# EAGLE design house-sensor4pre (EAGLE 6.4)
House Sensor API Project w/ Raspberry Pi
Assembly variants: attr
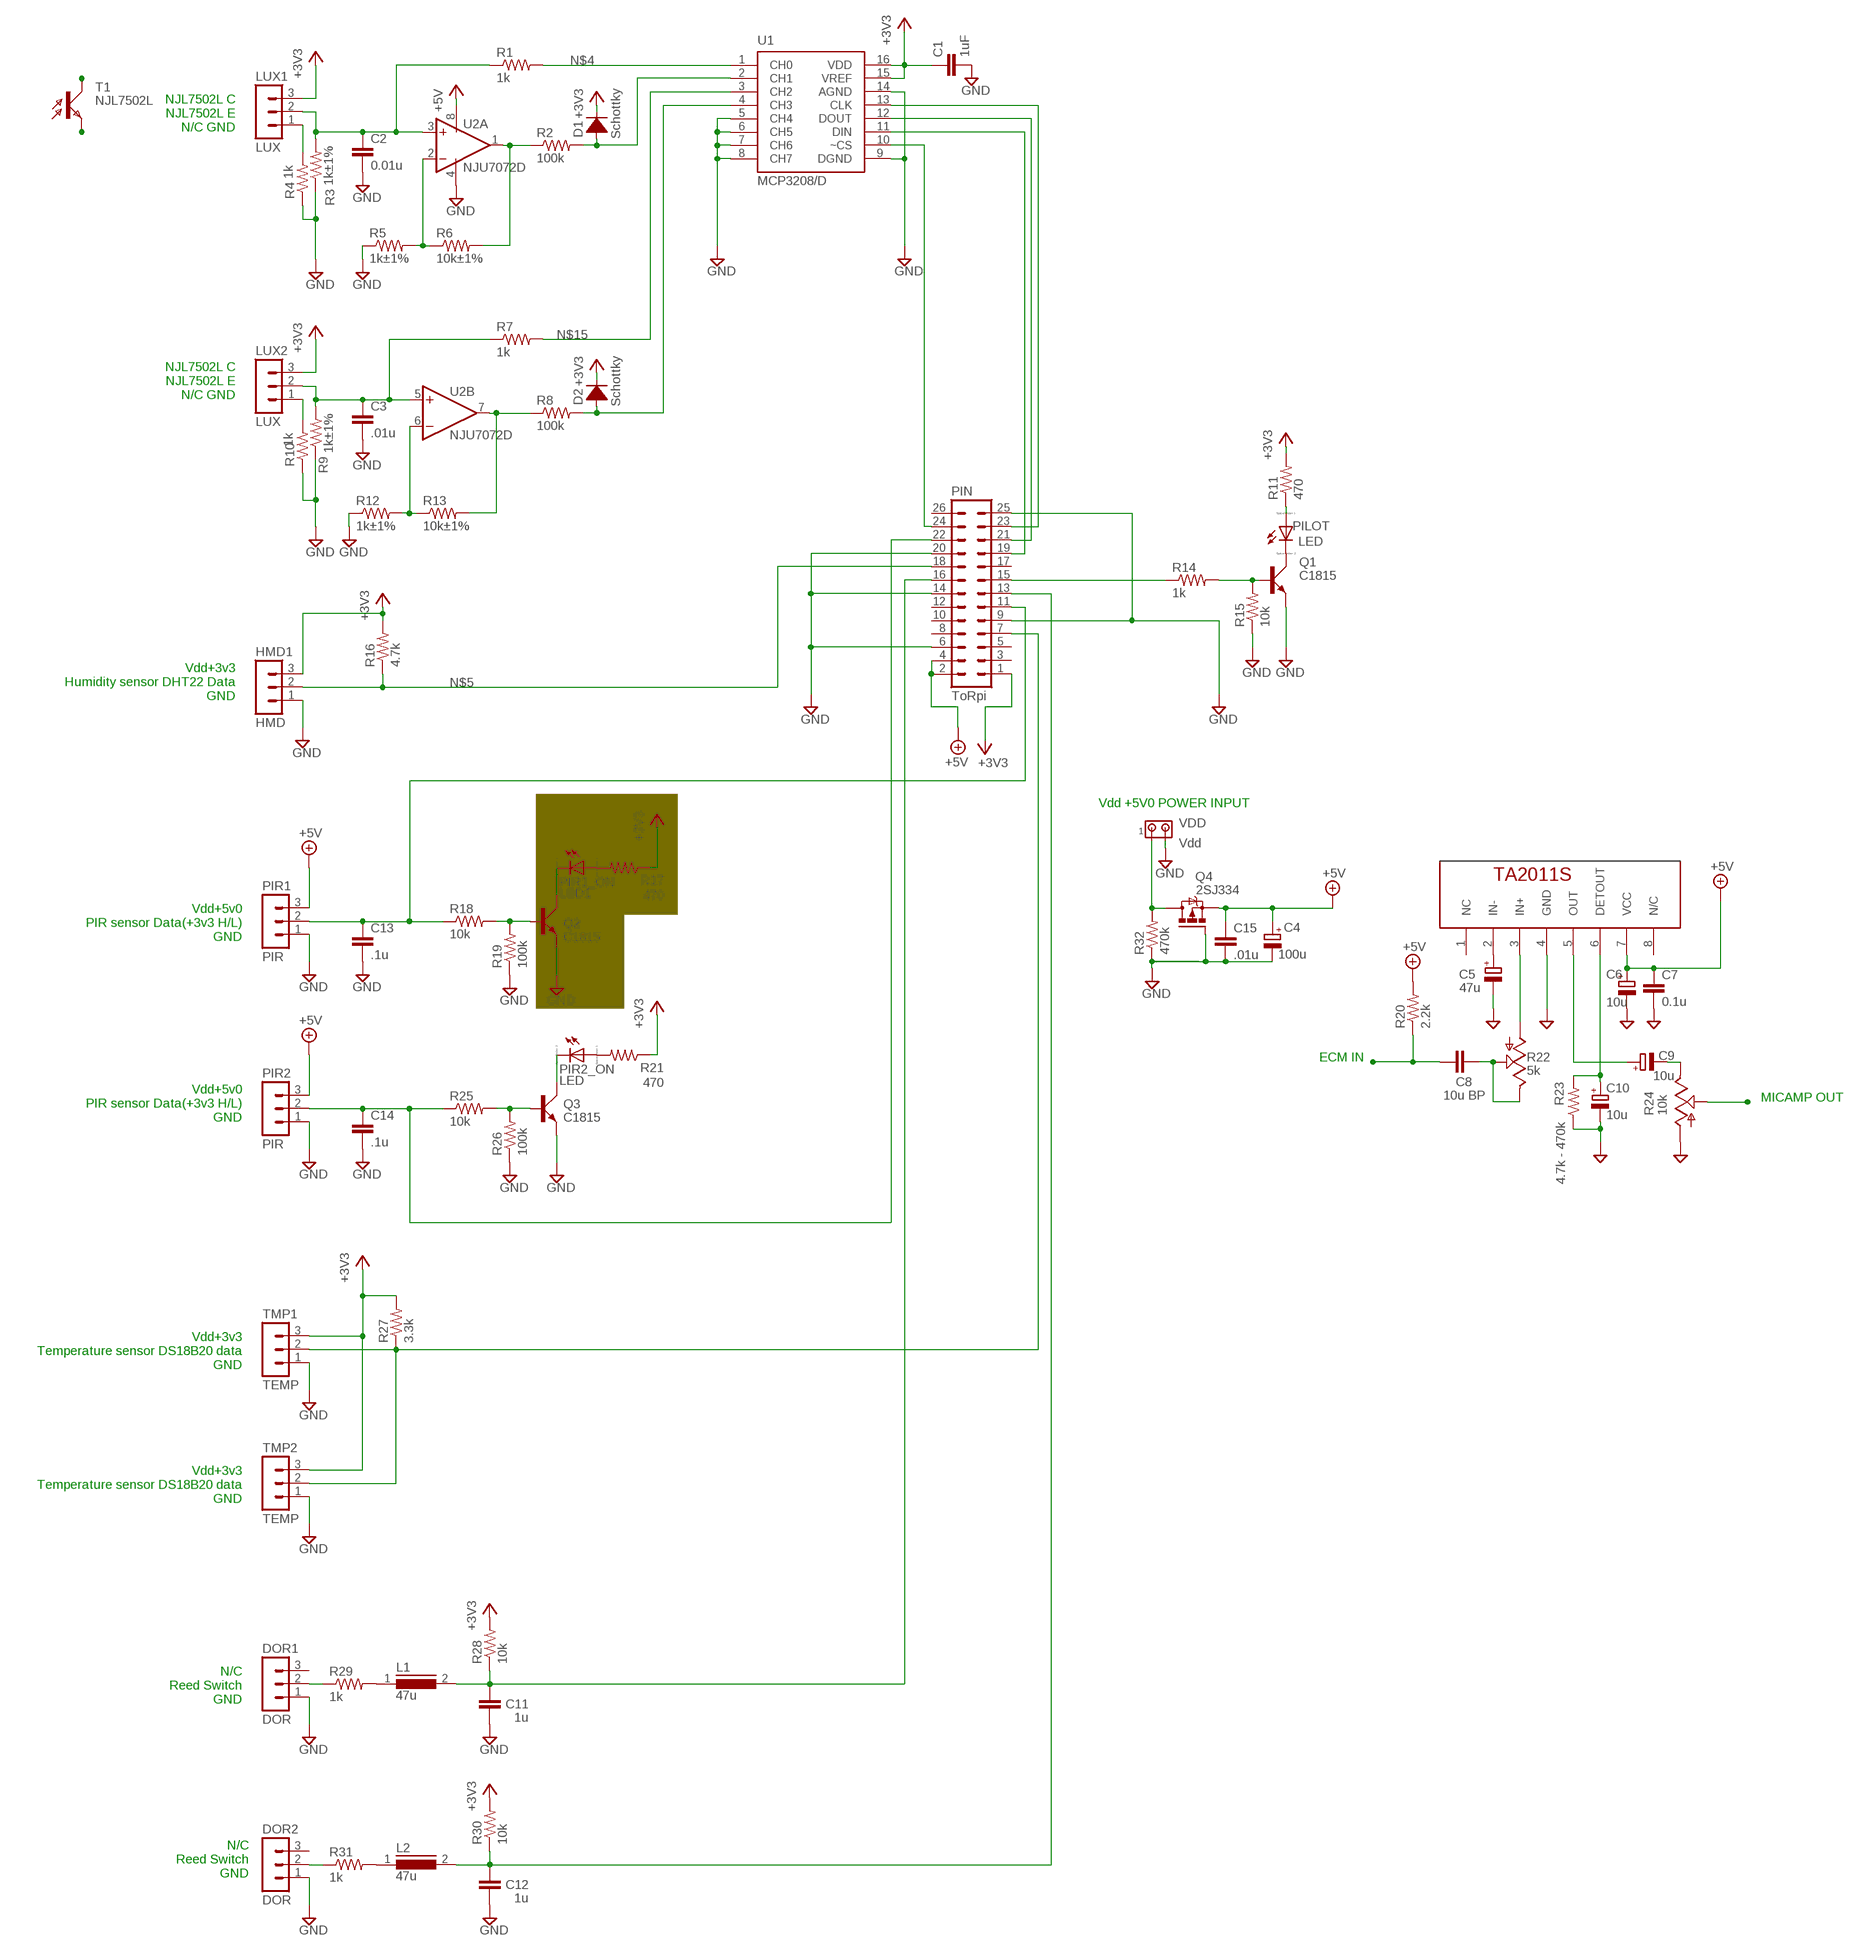
[diagram p0: schematic, sheet 1]

## Parts
C1  1uF  C-EU025-025X050  [C025-025X050]  (variant attr: a)
C2  0.01u  C-EU025-024X044  [C025-024X044]
C3  .01u  C-EU025-024X044  [C025-024X044]
C4  100u  CPOL-EUE1.8-4  [E1,8-4]
C5  47u  CPOL-EUE1.8-4  [E1,8-4]
C6  10u  CPOL-EUE1.8-4  [E1,8-4]
C7  0.1u  C  [C025-024X044]
C8  10u BP  C  [C025-024X044]
C9  10u  CPOL-EUE1.8-4  [E1,8-4]
C10  10u  CPOL-EUE1.8-4  [E1,8-4]
C11  1u  C-EU050-024X044  [C050-024X044]
C12  1u  C-EU050-024X044  [C050-024X044]
C13  .1u  C-EU025-030X050  [C025-030X050]
C14  .1u  C-EU025-030X050  [C025-030X050]
C15  .01u  C-EU025-025X050  [C025-025X050]
D1  Schottky  DIODE_V  [DIODE_V]
D2  Schottky  DIODE_V  [DIODE_V]
DOR1  DOR  MA03-1  [MA03-1]
DOR2  DOR  MA03-1  [MA03-1]
HMD1  HMD  MA03-1  [MA03-1]
L1  47u  LBC-SE  [LBC-SE]
L2  47u  LBC-SE  [LBC-SE]
LUX1  LUX  MA03-1  [MA03-1]
LUX2  LUX  MA03-1  [MA03-1]
PILOT  LED  LED_ELD260  [LED_LD260]
PIN  ToRpi  MA13-2  [MA13-2]
PIR1  PIR  MA03-1  [MA03-1]
PIR1_ON  LED1  LED_ELD260  [LED_LD260]
PIR2  PIR  MA03-1  [MA03-1]
PIR2_ON  LED  LED_ELD260  [LED_LD260]
Q1  C1815  2SC1815  [TO92-LINE]
Q2  C1815  2SC1815  [TO92-LINE]
Q3  C1815  2SC1815  [TO92-LINE]
R1  1k  R-US_0207/2V  [0207/2V]
R2  100k  R-US_0207/10  [0207/10]
R3  1k±1%  R-US_0207/2V  [0207/2V]
R4  1k  R-US_0309/V  [0309V]
R5  1k±1%  R-US_0207/2V  [0207/2V]
R6  10k±1%  R-US_0207/2V  [0207/2V]
R7  1k  R-US_0207/2V  [0207/2V]
R8  100k  R-US_0204/7  [0204/7]
R9  1k±1%  R-US_0207/2V  [0207/2V]
R10  1k  R-US_0309/V  [0309V]
R11  470  R-US_0207/2V  [0207/2V]
R12  1k±1%  R-US_0207/2V  [0207/2V]
R13  10k±1%  R-US_0207/2V  [0207/2V]
R14  1k  R-US_0204/2V  [0204V]
R15  10k  R-US_0207/2V  [0207/2V]
R16  4.7k  R-US_0207/2V  [0207/2V]
R17  470  R-US_0204/2V  [0204V]
R18  10k  R-US_0204/2V  [0204V]
R19  100k  R-US_0204/2V  [0204V]
R20  2.2k  R-US_0207/2V  [0207/2V]
R21  470  R-US_0204/2V  [0204V]
R22  5k  TRIM_US-B25P  [B25P]
R23  4.7k - 470k  R-US_0207/2V  [0207/2V]
R24  10k  TRIM_US-B25P  [B25P]
R25  10k  R-US_0204/2V  [0204V]
R26  100k  R-US_0204/2V  [0204V]
R27  3.3k  R-US_0204/2V  [0204V]
R28  10k  R-US_0204/2V  [0204V]
R29  1k  R-US_0207/5V  [0207/5V]
R30  10k  R-US_0204/2V  [0204V]
R31  1k  R-US_0207/5V  [0207/5V]
R32  470k  R-US_0204/2V  [0204V]
T1  NJL7502L  BPX81  [BPX81]
TMP1  TEMP  MA03-1  [MA03-1]
TMP2  TEMP  MA03-1  [MA03-1]
U1  MCP3208/D  MCP3208/DIP  [DIL16]
U2  NJU7072D  LM358N  [DIL08]
U$1  TA2011S  [SIP8]
VDD  Vdd  MTA02-100  [10X02MTA]

## Nets
+3V3: C1.1 D1.P$2(K) D2.P$2(K) HMD1.3 LUX1.3 LUX2.3 PIN.1 R11.2 R16.2 R17.1 R21.1 R27.2 R28.2 R30.2 TMP1.3 TMP2.3 U1.15(VREF) U1.16(VDD)
+5V: C4.+ C6.+ C7.1 C15.1 PIN.2 PIN.4 PIR1.3 PIR2.3 R20.2 U2.8(P:V+) U$1.7(VCC)
GND: C1.2 C2.2 C3.2 C4.- C5.- C6.- C7.2 C10.- C11.1 C12.1 C13.2 C14.2 C15.2 DOR1.1 DOR2.1 HMD1.1 PIN.6 PIN.9 PIN.14 PIN.20 PIN.25 PIR1.1 PIR2.1 Q1.3(E) Q2.3(E) Q3.3(E) R3.1 R4.1 R5.1 R9.1 R10.1 R12.1 R15.1 R19.1 R23.1 R24.A R26.1 R32.1 TMP1.1 TMP2.1 U1.5(CH4) U1.6(CH5) U1.7(CH6) U1.8(CH7) U1.9(DGND) U1.14(AGND) U2.4(P:V-) U$1.4(GND) VDD.2
N$1: C2.1 LUX1.2 R1.1 R3.2 U2.3(A:+IN)
N$2: R5.2 R6.1 U2.2(A:-IN)
N$3: R2.1 R6.2 U2.1(A:OUT)
N$4: R1.2 U1.1(CH0)
N$5: HMD1.2 PIN.18 R16.1
N$6: PIN.23 U1.13(CLK)
N$7: D1.P$1(A) R2.2 U1.2(CH1)
N$8: PIN.21 U1.12(DOUT)
N$9: PIN.19 U1.11(DIN)
N$10: R12.2 R13.1 U2.6(B:-IN)
N$11: R8.1 R13.2 U2.7(B:OUT)
N$12: C3.1 LUX2.2 R7.1 R9.2 U2.5(B:+IN)
N$13: PIN.24 U1.10(~CS)
N$14: D2.P$1(A) R8.2 U1.4(CH3)
N$15: R7.2 U1.3(CH2)
N$16: Q1.1(B) R14.2 R15.2
N$17: C13.1 PIN.11 PIR1.2 R18.1
N$18: Q2.1(B) R18.2 R19.2
N$19: PIR1_ON.K(C) Q2.2(C)
N$20: PIR1_ON.A R17.2
N$21: C14.1 PIN.22 PIR2.2 R25.1
N$22: Q3.1(B) R25.2 R26.2
N$23: PIR2_ON.K(C) Q3.2(C)
N$24: PIR2_ON.A R21.2
N$25: PILOT.K(C) Q1.2(C)
N$26: PILOT.A R11.1
N$27: PIN.7 R27.1 TMP1.2 TMP2.2
N$28: C12.2 L2.2 PIN.13 R30.1
N$29: R22.A U$1.3(IN+)
N$30: PIN.15 R14.1
N$31: L1.1 R29.2
N$32: DOR1.2 R29.1
N$33: L2.1 R31.2
N$34: DOR2.2 R31.1
N$35: C11.2 L1.2 PIN.16 R28.1
N$36: C9.+ U$1.5(OUT)
N$37: C9.- R24.E
N$38: LUX1.1 R4.2
N$39: LUX2.1 R10.2
N$40: R24.S
N$43: C8.2 R22.E R22.S
N$44: C8.1 R20.1
N$45: C10.+ R23.2 U$1.6(DETOUT)
N$46: C5.+ U$1.2(IN-)
N$47: T1.C
N$48: T1.E
N$49: R32.2 VDD.1
Unconnected: DOR1.3 DOR2.3 PIN.3 PIN.5 PIN.8 PIN.10 PIN.12 PIN.17 PIN.26 U$1.1(NC) U$1.8(N/C)

## Notes on the sheet
- NJL7502L C
  NJL7502L E
  N/C GND
- NJL7502L C
  NJL7502L E
  N/C GND
- Vdd+3v3
  Humidity sensor DHT22 Data
  GND
- Vdd +5V0 POWER INPUT
- Vdd+5v0
  PIR sensor Data(+3v3 H/L)
  GND
- ECM IN
- MICAMP OUT
- Vdd+5v0
  PIR sensor Data(+3v3 H/L)
  GND
- Vdd+3v3
  Temperature sensor DS18B20 data
  GND
- Vdd+3v3
  Temperature sensor DS18B20 data
  GND
- N/C
  Reed Switch
  GND
- N/C
  Reed Switch
  GND

## Library data of the parts
C1-C3 C11-C15 = akihabara:C-EU: CAPACITOR, European symbol
C4 = resistor:CPOL-EU: POLARIZED CAPACITOR, European symbol
C5 C6 C9 = rcl:CPOL-EU: POLARIZED CAPACITOR, European symbol
C7 C8 = akihabara:C
C10 = akihabara:CPOL-EU: POLARIZED CAPACITOR, European symbol
D1 D2 = 1-diode:DIODE_V: diode vertical
DOR1 DOR2 HMD1 LUX1 LUX2 PIR1 PIR2 TMP1 TMP2 = con-lstb:MA03-1: PIN HEADER; OC_FARNELL: unknown; OC_NEWARK: unknown
L1 L2 = inductors:LBC-SE: INDUCTOR
PILOT PIR1_ON PIR2_ON = eagle-ltspice:LED_E: LED Source: http://www.osram.convergy.de Source: www.luxeon.com Source: www.kingbright.com; SPICEMODEL: NONE; SPICEPREFIX: D; SPICETYPE: diode
PIN = con-lstb:MA13-2: PIN HEADER; OC_FARNELL: unknown; OC_NEWARK: unknown
Q1-Q3 = akihabara:2SC1815: 2SC1815 Audio frequency general purpose amplifier. Package ECB. Complementary to 2SA1015
R1-R21 R23 R25-R32 = akihabara:R-US_: RESISTOR, American symbol
R22 R24 = akihabara:TRIM_US-: POTENTIOMETER
T1 = opto-trans-siemens:BPX81: PHOTO TRANSISTOR; OC_FARNELL: unknown; OC_NEWARK: unknown
U1 = mcp3208:MCP3208/DIP
U2 = linear:LM358: OP AMP also LM158; LM258; LM2904 Source: http://cache.national.com/ds/LM/LM158.pdf
U$1 = ta2011:TA2011S
VDD = con-amp:MTA02-100: AMP connector

## Board
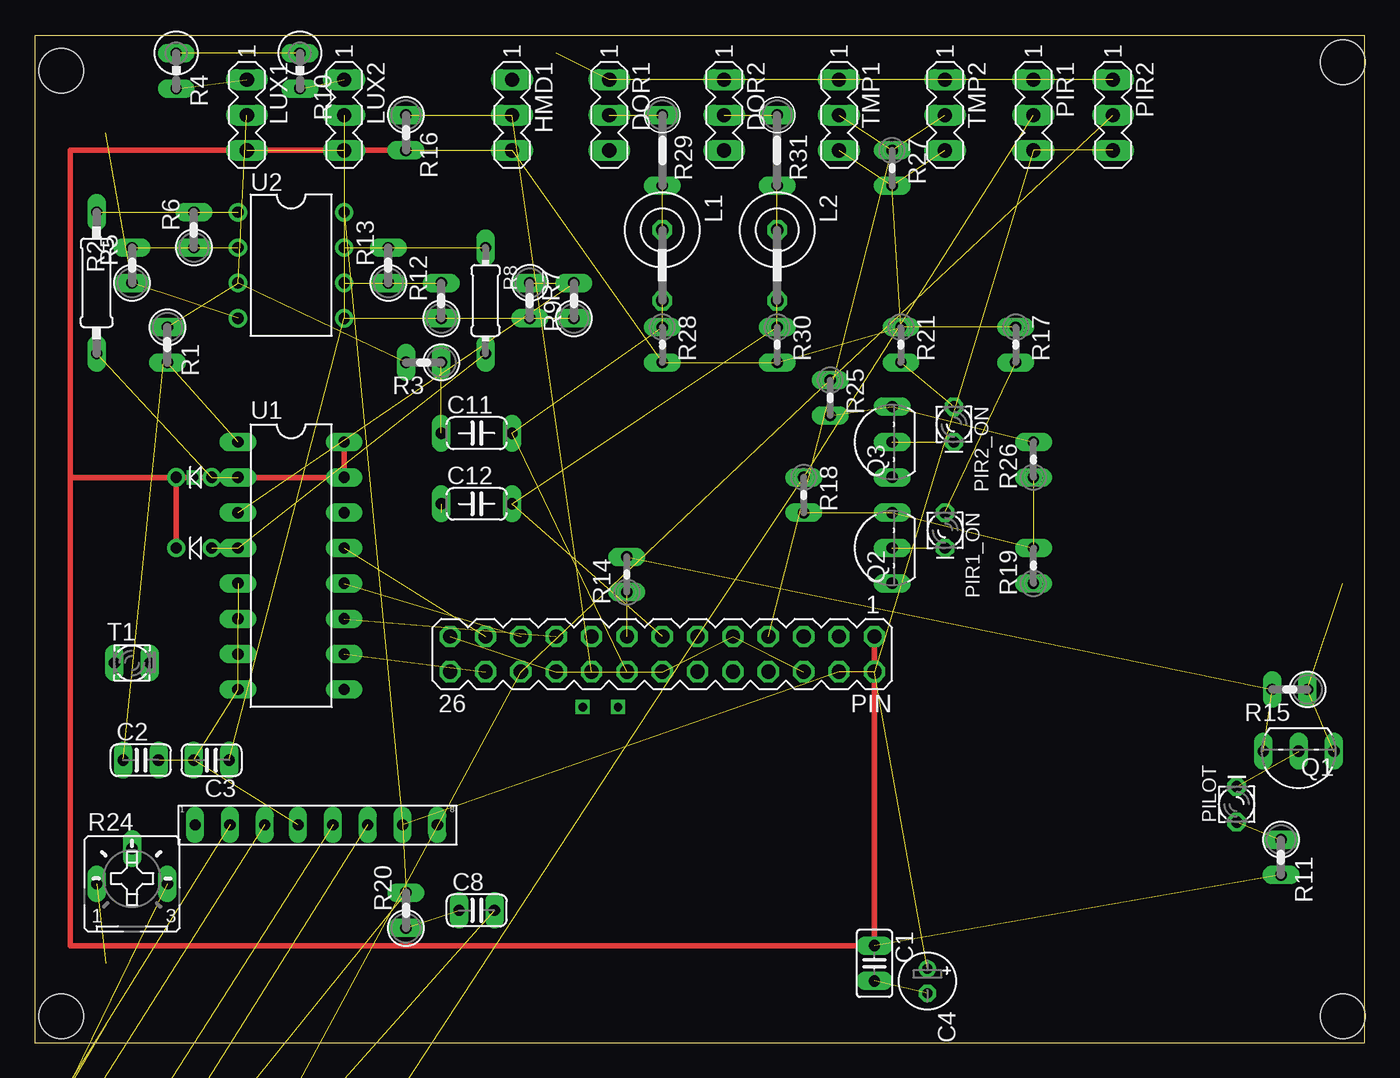
[diagram p1: board, top side]
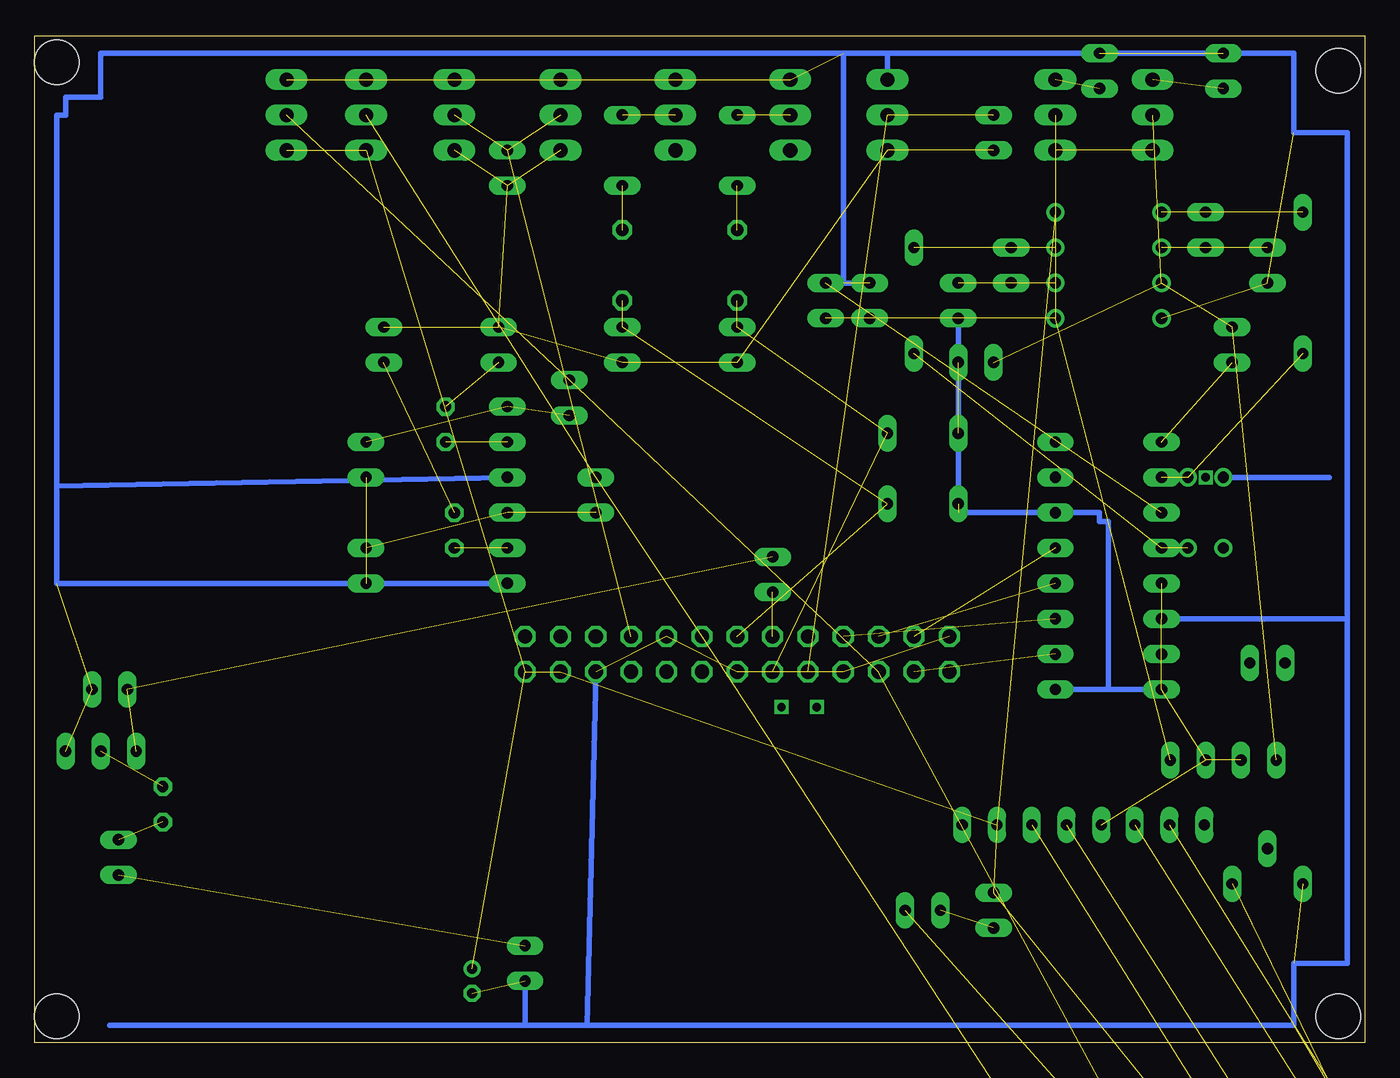
[diagram p2: board, bottom side, seen from below]

Size 95.56 x 72.38 mm. Coordinates in mm from the lower left corner, seen from the top.
Outline: 0,0 95.56,0 95.56,72.38 0,72.38 0,0
Copper layers (1*16): Top 0.035mm / dielectric 1.5mm / Bottom 0.035mm
Design rules "default": minimum track width 10mil, minimum drill 24mil, track to track 12mil, track to pad 12mil, pad to pad 12mil, via to via 12mil, smd to smd 12mil, copper to edge 40mil, drill to drill 8mil, minimum pad ring 10mil, minimum via ring 8mil, stop-mask expansion 4mil, vias tented up to drill 0mil, thermal gap 10mil
Holes 3.2 mm at 1.91,69.85 1.91,1.91 93.98,1.91 93.98,70.48

### Footprints (pad centres in the part's own frame; a part is rotated, then mirrored left to right if it is on the bottom)
C025-025X050 = drill 0.813 long: 1 -1.27,0; 2 1.27,0
C025-024X044 = drill 0.813 long: 1 -1.27,0; 2 1.27,0
E1,8-4 = drill 0.711 pad 1.168: + -0.889,0 | drill 0.711 pad 1.168 octagon: - 0.889,0
E1,8-4' = drill 0.711 pad 1.168 long: + -0.889,0; - 0.889,0
C050-024X044 = drill 0.813 long: 1 -2.54,0; 2 2.54,0
C025-030X050 = drill 0.813 long: 1 -1.27,0; 2 1.27,0
DIODE_V = drill 0.8: P$1 -2.54,0; P$2 0,0
MA03-1 = drill 1.016 long: 1 -2.54,0; 2 0,0; 3 2.54,0
LBC-SE = drill 0.914 octagon: 1 -2.54,0; 2 2.54,0
LED_LD260 = drill 0.813 octagon: A -1.27,0; K 1.27,0
MA13-2 = drill 1.016 octagon: 1 -15.24,-1.27; 2 -15.24,1.27; 3 -12.7,-1.27; 4 -12.7,1.27; 5 -10.16,-1.27; 6 -10.16,1.27; 7 -7.62,-1.27; 8 -7.62,1.27; 9 -5.08,-1.27; 10 -5.08,1.27; 11 -2.54,-1.27; 12 -2.54,1.27; 13 0,-1.27; 14 0,1.27; 15 2.54,-1.27; 16 2.54,1.27; 17 5.08,-1.27; 18 5.08,1.27; 19 7.62,-1.27; 20 7.62,1.27; 21 10.16,-1.27; 22 10.16,1.27; 23 12.7,-1.27; 24 12.7,1.27; 25 15.24,-1.27; 26 15.24,1.27
TO92-LINE = drill 0.813 long: 1 2.54,0; 2 0,0; 3 -2.54,0
0207/2V = drill 0.813 long: 1 -1.27,0; 2 1.27,0
0207/10 = drill 0.813 long: 1 -5.08,0; 2 5.08,0
0309V = drill 0.813 long: 1 -1.27,0; 2 1.27,0
0204/7 = drill 0.813 long: 1 -3.81,0; 2 3.81,0
0204V = drill 0.813 long: 1 -1.27,0; 2 1.27,0
B25P = drill 0.813 long: A -2.54,0; E 2.54,0; S 0,2.54
0207/5V = drill 0.813 long: 1 -2.54,0; 2 2.54,0
BPX81 = drill 0.813 long: C 1.27,0; E -1.27,0
DIL16 = drill 0.813 long: 1 -8.89,-3.81; 2 -6.35,-3.81; 3 -3.81,-3.81; 4 -1.27,-3.81; 5 1.27,-3.81; 6 3.81,-3.81; 7 6.35,-3.81; 8 8.89,-3.81; 9 8.89,3.81; 10 6.35,3.81; 11 3.81,3.81; 12 1.27,3.81; 13 -1.27,3.81; 14 -3.81,3.81; 15 -6.35,3.81; 16 -8.89,3.81
DIL08 = drill 0.813 pad 1.27: 1 -3.81,-3.81; 2 -1.27,-3.81; 3 1.27,-3.81; 4 3.81,-3.81; 5 3.81,3.81; 6 1.27,3.81; 7 -1.27,3.81; 8 -3.81,3.81
SIP8 = drill 0.8 long: 1 -8.8,3.6; 2 -6.3,3.6; 3 -3.8,3.6; 4 -1.4,3.6; 5 1.1,3.6; 6 3.6,3.6; 7 6.1,3.6; 8 8.6,3.6
10X02MTA = drill 1.016 long: 1 1.27,0; 2 -1.27,0

### Placement (x,y rotation side)
C1  60.33,5.71 270 top
C2  7.62,20.32 0 top
C3  12.7,20.32 180 top
C4  64.14,4.45 270 top
C5  -27.3,-52.07 0 top  (outside the outline)
C6  -27.3,-57.15 0 top  (outside the outline)
C7  -35.56,-83.82 0 top  (outside the outline)
C8  31.75,9.53 0 top
C9  -27.3,-62.23 0 top  (outside the outline)
C10  10u  [E1,8-4']  -27.3,-67.31 0 top  (outside the outline)
C11  31.75,43.81 0 top
C12  31.75,38.73 0 top
C13  -34.92,-99.06 0 top  (outside the outline)
C14  -34.92,-104.78 0 top  (outside the outline)
C15  -34.92,-111.76 0 top  (outside the outline)
D1  10.16,40.64 180 top
D2  10.16,35.56 180 top
DOR1  41.27,66.67 270 top
DOR2  49.53,66.67 270 top
HMD1  34.29,66.67 270 top
L1  45.09,55.88 270 top
L2  53.34,55.88 270 top
LUX1  15.24,66.67 270 top
LUX2  22.23,66.67 270 top
PILOT  86.36,17.14 90 top
PIN  45.09,27.94 180 top
PIR1  71.75,66.67 270 top
PIR1_ON  65.41,36.83 270 top
PIR2  77.47,66.67 270 top
PIR2_ON  66.04,44.45 270 top
Q1  90.81,20.95 180 top
Q2  61.59,35.56 90 top
Q3  61.59,43.18 90 top
R1  9.53,50.16 270 top
R2  4.45,54.61 270 top
R3  27.94,48.9 180 top
R4  10.16,69.85 270 top
R5  6.99,55.88 90 top
R6  11.43,58.42 90 top
R7  38.73,53.34 90 top
R8  32.38,53.34 270 top
R9  35.56,53.34 270 top
R10  19.05,69.85 270 top
R11  89.53,13.34 270 top
R12  29.21,53.34 90 top
R13  25.4,55.88 90 top
R14  42.55,33.66 90 top
R15  90.17,25.4 180 top
R16  26.67,65.41 270 top
R17  70.48,50.16 270 top
R18  55.24,39.37 270 top
R19  71.75,34.29 90 top
R20  26.67,9.53 90 top
R21  62.23,50.16 270 top
R22  -34.29,-68.58 0 top  (outside the outline)
R23  -34.92,-77.47 0 top  (outside the outline)
R24  6.99,11.43 0 top
R25  57.15,46.35 270 top
R26  71.75,41.91 90 top
R27  61.59,62.87 270 top
R28  45.09,50.16 270 top
R29  45.09,64.14 270 top
R30  53.34,50.16 270 top
R31  53.34,64.14 270 top
R32  -34.92,-118.11 0 top  (outside the outline)
T1  6.99,27.3 0 top
TMP1  57.78,66.67 270 top
TMP2  65.41,66.67 270 top
U1  18.41,34.29 270 top
U2  18.41,55.88 270 top
U$1  20.32,12.06 0 top
VDD  -34.29,-91.44 0 top  (outside the outline)

### Tracks (layer width: path | path; a pad name or v marks a point on that pad's centre or on a via)
+3V3  (via drill 0.6)  (10 unrouted)
  Top 0.406: 2.54,40.64 2.54,64.14 LUX2.3 R16.2 | 2.54,40.64 2.54,6.99 C1.1 PIN.1 | D1.P$2 2.54,40.64 | D2.P$2 D1.P$2 | D1.P$2 v11.43,40.64 U1.15 U1.16
  Bottom 0.406: D1.P$2 2.54,40.64
+5V  (10 unrouted)
GND  (37 unrouted)
  Bottom 0.406: 1.27,30.48 1.27,65.41 5.08,65.41 5.08,71.12 R4.1 34.29,71.12 | 1.27,30.48 1.27,5.71 5.08,5.71 5.08,1.27 55.88,1.27 | 55.88,1.27 60.33,1.27 | 60.33,1.27 90.17,1.27 | 34.29,71.12 37.47,71.12 | 37.47,71.12 90.81,71.12 90.81,67.94 93.34,67.94 93.34,66.67 93.98,66.67 93.98,40.01 | 1.27,30.48 U1.6 | U1.8 18.41,25.4 | 18.41,25.4 U1.9 | 22.86,38.1 U1.14 | U1.14 19.05,38.1 19.05,37.47 18.41,37.47 18.41,25.4 | C1.2 60.33,1.27 | PIN.6 55.88,1.27 | 34.29,71.12 HMD1.1 | 37.47,71.12 37.47,54.61 | 39.37,54.61 R9.1 | 93.98,40.01 93.98,33.02 R19.1 Q2.3 | Q3.3 93.98,40.01 | U1.14 29.21,38.1 R3.1 R12.1
N$1  (4 unrouted)
N$2  (2 unrouted)
N$3  (2 unrouted)
N$4  (1 unrouted)
N$5  (2 unrouted)
N$6  (1 unrouted)
N$7  (2 unrouted)
N$8  (1 unrouted)
N$9  (1 unrouted)
N$10  (2 unrouted)
N$11  (2 unrouted)
N$12  (4 unrouted)
N$13  (1 unrouted)
N$14  (2 unrouted)
N$15  (1 unrouted)
N$16  (2 unrouted)
N$17  (3 unrouted)
N$18  (2 unrouted)
N$19  (1 unrouted)
N$20  (1 unrouted)
N$21  (3 unrouted)
N$22  (2 unrouted)
N$23  (1 unrouted)
N$24  (1 unrouted)
N$25  (1 unrouted)
N$26  (1 unrouted)
N$27  (3 unrouted)
N$28  (3 unrouted)
N$29  (1 unrouted)
N$30  (1 unrouted)
N$31  (1 unrouted)
N$32  (1 unrouted)
N$33  (1 unrouted)
N$34  (1 unrouted)
N$35  (3 unrouted)
N$36  (1 unrouted)
N$37  (1 unrouted)
N$38  (1 unrouted)
N$39  (1 unrouted)
N$41  (via drill 0.6)
  other vias: 39.37,24.13
N$42  (via drill 0.6)
  other vias: 41.91,24.13
N$43  (2 unrouted)
N$44  (1 unrouted)
N$45  (2 unrouted)
N$46  (1 unrouted)
N$49  (1 unrouted)